# Altium schematic sheet LPCB279 - HBRIDGE.SchDoc
size A3; Address1: Factory 10; Address2: 9-13 Dingley Avenue, Dandeong, VICTORIA 3175, AUSTRALIA; DocumentNumber: 4; Revision: 1; SheetNumber: 4; SheetTotal: 7; Lockie__PCB_SUB_ASSEMBLY: PCB Sub Component; Lockie__PCB_ASSEMBLY: PCB Assembly; Lockie__LDL: LPCB279; Lockie__PCB_DESCRIPTION: Landing Gear Unit
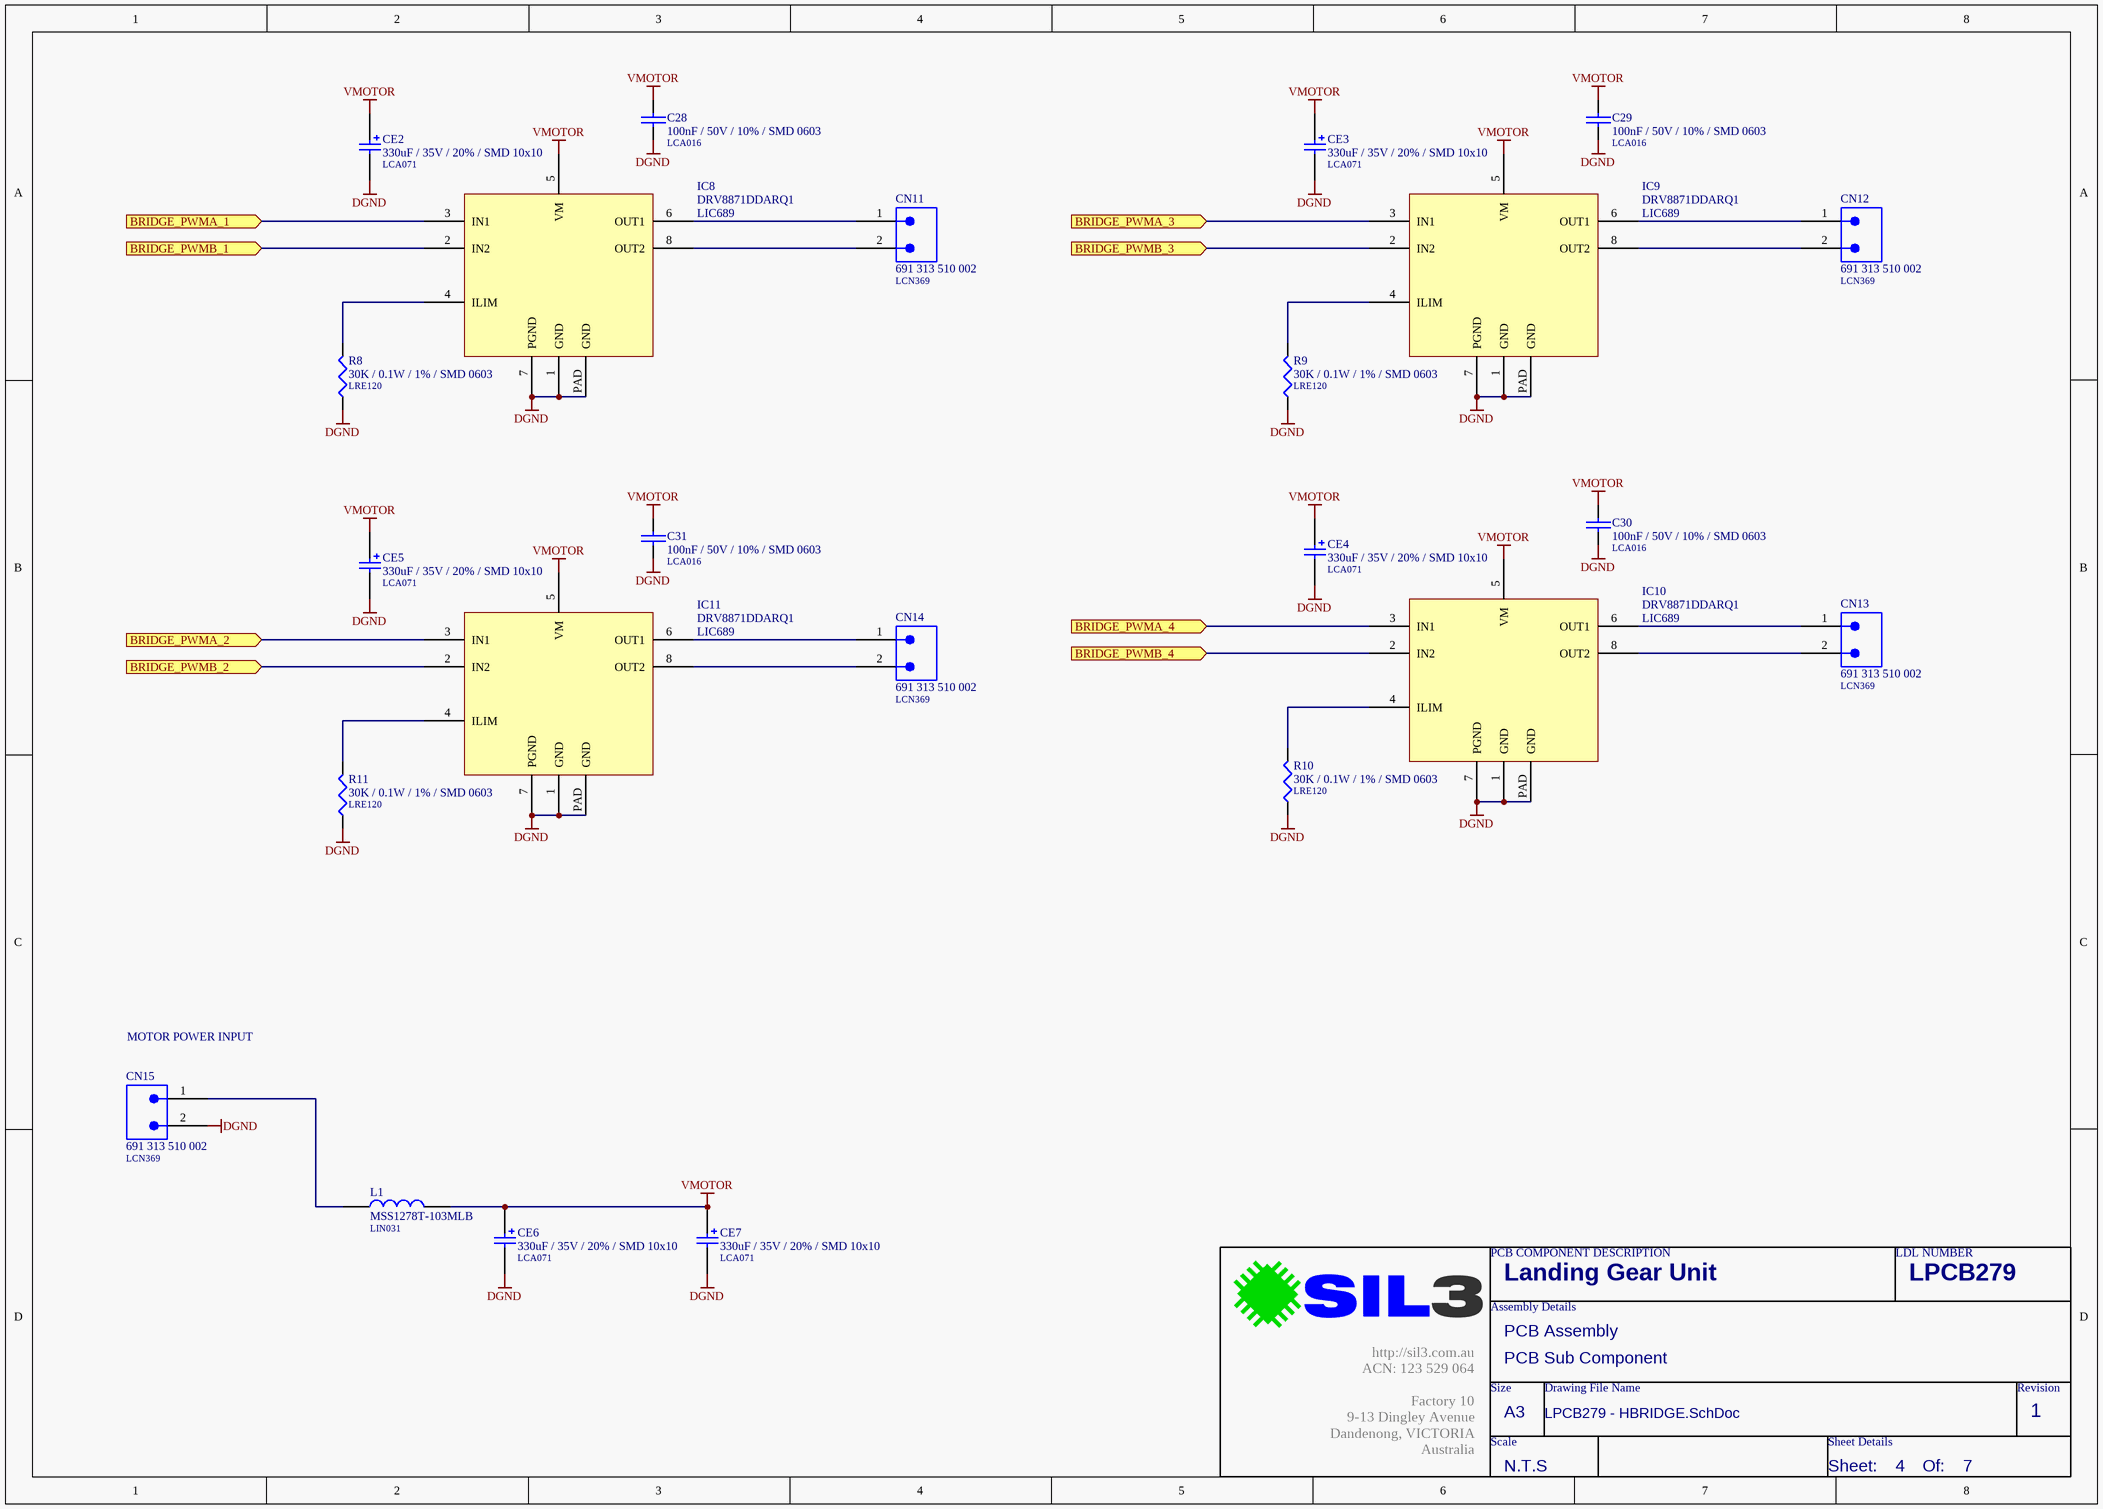
[diagram p0: LPCB279 - HBRIDGE.SchDoc]

## Parts
C28  100nF / 50V / 10% / SMD 0603  LDL_NUMBER: LCA016  [LFP011__CC1608-0603-IPC7351_B]
C29  100nF / 50V / 10% / SMD 0603  LDL_NUMBER: LCA016  [LFP011__CC1608-0603-IPC7351_B]
C30  100nF / 50V / 10% / SMD 0603  LDL_NUMBER: LCA016  [LFP011__CC1608-0603-IPC7351_B]
C31  100nF / 50V / 10% / SMD 0603  LDL_NUMBER: LCA016  [LFP011__CC1608-0603-IPC7351_B]
CE2  330uF / 35V / 20% / SMD 10x10  LDL_NUMBER: LCA071  [LFP041__NICHICON_WT_10X10]
CE3  330uF / 35V / 20% / SMD 10x10  LDL_NUMBER: LCA071  [LFP041__NICHICON_WT_10X10]
CE4  330uF / 35V / 20% / SMD 10x10  LDL_NUMBER: LCA071  [LFP041__NICHICON_WT_10X10]
CE5  330uF / 35V / 20% / SMD 10x10  LDL_NUMBER: LCA071  [LFP041__NICHICON_WT_10X10]
CE6  330uF / 35V / 20% / SMD 10x10  LDL_NUMBER: LCA071  [LFP041__NICHICON_WT_10X10]
CE7  330uF / 35V / 20% / SMD 10x10  LDL_NUMBER: LCA071  [LFP041__NICHICON_WT_10X10]
CN11  691 313 510 002  LDL_NUMBER: LCN369  [691 313 510 002]
CN12  691 313 510 002  LDL_NUMBER: LCN369  [691 313 510 002]
CN13  691 313 510 002  LDL_NUMBER: LCN369  [691 313 510 002]
CN14  691 313 510 002  LDL_NUMBER: LCN369  [691 313 510 002]
CN15  691 313 510 002  LDL_NUMBER: LCN369  [691 313 510 002]
IC8  DRV8871DDARQ1  LDL_NUMBER: LIC689  [LFP158__DDA_R-PDSO-G8]
IC9  DRV8871DDARQ1  LDL_NUMBER: LIC689  [LFP158__DDA_R-PDSO-G8]
IC10  DRV8871DDARQ1  LDL_NUMBER: LIC689  [LFP158__DDA_R-PDSO-G8]
IC11  DRV8871DDARQ1  LDL_NUMBER: LIC689  [LFP158__DDA_R-PDSO-G8]
L1  MSS1278T-103MLB  LDL_NUMBER: LIN031  [LFP037__MSS1278T]
R8  30K / 0.1W / 1% / SMD 0603  LDL_NUMBER: LRE120  [LFP020__CR1608-0603-IPC7351_B]
R9  30K / 0.1W / 1% / SMD 0603  LDL_NUMBER: LRE120  [LFP020__CR1608-0603-IPC7351_B]
R10  30K / 0.1W / 1% / SMD 0603  LDL_NUMBER: LRE120  [LFP020__CR1608-0603-IPC7351_B]
R11  30K / 0.1W / 1% / SMD 0603  LDL_NUMBER: LRE120  [LFP020__CR1608-0603-IPC7351_B]

## Ports
BRIDGE_PWMA_1 (in), BRIDGE_PWMA_2 (in), BRIDGE_PWMA_3 (in), BRIDGE_PWMA_4 (in), BRIDGE_PWMB_1 (in), BRIDGE_PWMB_2 (in), BRIDGE_PWMB_3 (in), BRIDGE_PWMB_4 (in)

## Nets
DGND: C28.2 C29.2 C30.2 C31.2 CE2.2 CE3.2 CE4.2 CE5.2 CE6.2 CE7.2 CN15.2 IC8.1(GND) IC8.7(PGND) IC8.PAD(GND) IC9.1(GND) IC9.7(PGND) IC9.PAD(GND) IC10.1(GND) IC10.7(PGND) IC10.PAD(GND) IC11.1(GND) IC11.7(PGND) IC11.PAD(GND) R8.1 R9.1 R10.1 R11.1
VMOTOR: C28.1 C29.1 C30.1 C31.1 CE2.1 CE3.1 CE4.1 CE5.1 CE6.1 CE7.1 IC8.5(VM) IC9.5(VM) IC10.5(VM) IC11.5(VM) L1.2
BRIDGE_PWMA_1: IC8.3(IN1) ; port BRIDGE_PWMA_1
BRIDGE_PWMA_2: IC11.3(IN1) ; port BRIDGE_PWMA_2
BRIDGE_PWMA_3: IC9.3(IN1) ; port BRIDGE_PWMA_3
BRIDGE_PWMA_4: IC10.3(IN1) ; port BRIDGE_PWMA_4
BRIDGE_PWMB_1: IC8.2(IN2) ; port BRIDGE_PWMB_1
BRIDGE_PWMB_2: IC11.2(IN2) ; port BRIDGE_PWMB_2
BRIDGE_PWMB_3: IC9.2(IN2) ; port BRIDGE_PWMB_3
BRIDGE_PWMB_4: IC10.2(IN2) ; port BRIDGE_PWMB_4
NetCN11_1: CN11.1 IC8.6(OUT1)
NetCN11_2: CN11.2 IC8.8(OUT2)
NetCN12_1: CN12.1 IC9.6(OUT1)
NetCN12_2: CN12.2 IC9.8(OUT2)
NetCN13_1: CN13.1 IC10.6(OUT1)
NetCN13_2: CN13.2 IC10.8(OUT2)
NetCN14_1: CN14.1 IC11.6(OUT1)
NetCN14_2: CN14.2 IC11.8(OUT2)
NetCN15_1: CN15.1 L1.1
NetIC8_4: IC8.4(ILIM) R8.2
NetIC9_4: IC9.4(ILIM) R9.2
NetIC10_4: IC10.4(ILIM) R10.2
NetIC11_4: IC11.4(ILIM) R11.2

## Notes on the sheet
- MOTOR POWER INPUT
- PCB COMPONENT DESCRIPTION
- LDL NUMBER
- Assembly Details
- Size
- Drawing File Name
- Revision
- http://sil3.com.au
  ACN: 123 529 064
  Factory 10
  9-13 Dingley Avenue
  Dandenong, VICTORIA
  Australia
- Scale
- A3
- Sheet Details
- N.T.S
- Sheet:
- Of:

## Library data of the parts
C28-C31 = 100nF / 50V / 10% / SMD 0603: Capacitor, Ceramic Chip, 100nF (0.1uF), 50V, 5%, SMD 0603 [LCA016]; Value: 100n; FMEDA__OPERATING__VOLTAGE_MIN: 0; FMEDA__OPERATING__VOLTAGE_MAX: 3.3; FMEDA__OPERATING__TEMP_MIN: -20; FMEDA__OPERATING__TEMP_TYP: 27; FMEDA__OPERATING__TEMP_MAX: 50; FMEDA__CHANNEL: COM; FMEDA__FUNCTION_IN_SYSTEM: *; FMEDA__OPERATING__VOLTAGE_TYP: 3.3
CE2-CE7 = 330uF / 35V / 20% / SMD 10x10: Capacitor, Aluminum Electrolytic, 330uF, 35V, 20%, SMD (10mm x 10mm) [LCA071]; FMEDA__OPERATING__TEMP_MAX: 50; FMEDA__OPERATING__TEMP_MIN: -20; FMEDA__OPERATING__TEMP_TYP: 27; FMEDA__OPERATING__VOLTAGE_MAX: 0; Value: 330u; FMEDA__CHANNEL: COM; FMEDA__OPERATING__VOLTAGE_MIN: 0; FMEDA__OPERATING__VOLTAGE_TYP: 0; FMEDA__FUNCTION_IN_SYSTEM: *
CN11-CN15 = 691 313 510 002: Connector, Pluggable Terminal Block, 5.08mm, 2 Way, PTH; FMEDA__CHANNEL: COM; FMEDA__OPERATING__CURRENT_MAX: 0; FMEDA__OPERATING__TEMP_MAX: 50; FMEDA__OPERATING__TEMP_MIN: -20; FMEDA__OPERATING__TEMP_TYP: 27; FMEDA__OPERATING__VOLTAGE_MAX: 16; FMEDA__OPERATING__VOLTAGE_TYP: 12; FMEDA__FUNCTION_IN_SYSTEM: *; FMEDA__OPERATING__CURRENT_MIN: 0; FMEDA__OPERATING__CURRENT_TYP: 0; FMEDA__OPERATING__VOLTAGE_MIN: 0
IC8-IC11 = DRV8871DDARQ1: IC, DC Motor Driver, 3.6A, SMD [LIC689]
L1 = MSS1278T-103MLB: Inductor, 10uH, 20%, 5.7A, SMD [LIN031]; FMEDA__OPERATING__TEMP_MAX: 50; FMEDA__OPERATING__TEMP_MIN: -20; FMEDA__OPERATING__TEMP_TYP: 27; Value: 10u; FMEDA__CHANNEL: COM; Revision: 1; FMEDA__FUNCTION_IN_SYSTEM: *
R8-R11 = 30K / 0.1W / 1% / SMD 0603: Resistor, Ceramic Chip, 30K, 0.1W, 1%, SMD 0603 [LRE120]; FMEDA__OPERATING__POWER_MAX: 0; FMEDA__OPERATING__TEMP_MAX: 50; FMEDA__OPERATING__TEMP_MIN: -20; FMEDA__OPERATING__TEMP_TYP: 27; FMEDA__CHANNEL: COM; Value: 30K; FMEDA__FUNCTION_IN_SYSTEM: *; FMEDA__OPERATING__POWER_MIN: 0; FMEDA__OPERATING__VOLTAGE_MAX: 0; FMEDA__OPERATING__VOLTAGE_MIN: 0; FMEDA__OPERATING__VOLTAGE_TYP: 0